# Altium schematic sheet BioZ_Sensor.SchDoc
size 420 x 297 mm
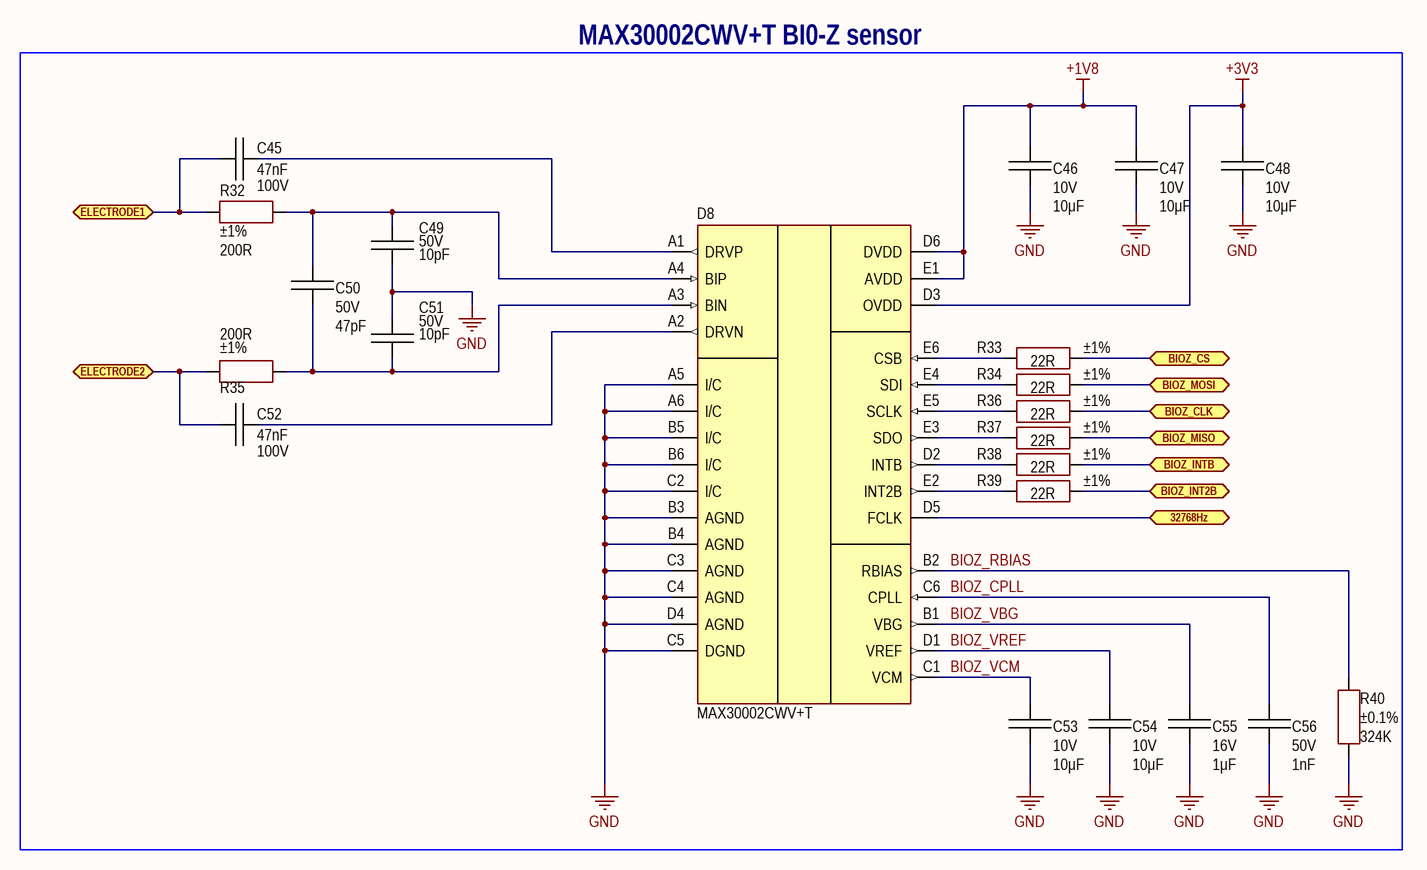
[diagram p0: BioZ_Sensor.SchDoc]

## Parts
C45  value 47nF  Voltage: 100V  [CAP: 0805]
C46  value 10μF  Voltage: 10V  [CAP: 0805]
C47  value 10μF  Voltage: 10V  [CAP: 0805]
C48  value 10μF  Voltage: 10V  [CAP: 0805]
C49  value 10pF  Voltage: 50V  [CAP: 0805]
C50  value 47pF  Voltage: 50V  [CAP: 0805]
C51  value 10pF  Voltage: 50V  [CAP: 0805]
C52  value 47nF  Voltage: 100V  [CAP: 0805]
C53  value 10μF  Voltage: 10V  [CAP: 0805]
C54  value 10μF  Voltage: 10V  [CAP: 0805]
C55  value 1μF  Voltage: 16V  [CAP: 0805]
C56  value 1nF  Voltage: 50V  [CAP: 0805]
D8  (no value)  [IC: 30-WLP]
R32  value 200R  Tolerance: ±1%  [RES: 0805]
R33  value 22R  Tolerance: ±1%  [RES: 0805]
R34  value 22R  Tolerance: ±1%  [RES: 0805]
R35  value 200R  Tolerance: ±1%  [RES: 0805]
R36  value 22R  Tolerance: ±1%  [RES: 0805]
R37  value 22R  Tolerance: ±1%  [RES: 0805]
R38  value 22R  Tolerance: ±1%  [RES: 0805]
R39  value 22R  Tolerance: ±1%  [RES: 0805]
R40  value 324K  Tolerance: ±0.1%  [RES: 0805]

## Blocks framed on the sheet
MAX30002CWV+T BI0-Z sensor: C45-C56 D8 R32-R40

## Ports
32768Hz (bidir), BIOZ_CLK (bidir), BIOZ_CS (bidir), BIOZ_INT2B (bidir), BIOZ_INTB (bidir), BIOZ_MISO (bidir), BIOZ_MOSI (bidir), ELECTRODE1 (bidir), ELECTRODE2 (bidir)

## Nets
+1V8: C46.2 C47.2 D8.D6(DVDD) D8.E1(AVDD)
+3V3: C48.2 D8.D3(OVDD)
GND: C46.1 C47.1 C48.1 C49.1 C51.2 C53.1 C54.1 C55.1 C56.1 D8.A5(I/C) D8.A6(I/C) D8.B3(AGND) D8.B4(AGND) D8.B5(I/C) D8.B6(I/C) D8.C2(I/C) D8.C3(AGND) D8.C4(AGND) D8.C5(DGND) D8.D4(AGND) R40.1
32768Hz: D8.D5(FCLK) ; port 32768Hz
BIOZ_CLK: R36.2 ; port BIOZ_CLK
BIOZ_CPLL: C56.2 D8.C6(CPLL)
BIOZ_CS: R33.2 ; port BIOZ_CS
BIOZ_INT2B: R39.2 ; port BIOZ_INT2B
BIOZ_INTB: R38.2 ; port BIOZ_INTB
BIOZ_MISO: R37.2 ; port BIOZ_MISO
BIOZ_MOSI: R34.2 ; port BIOZ_MOSI
BIOZ_RBIAS: D8.B2(RBIAS) R40.2
BIOZ_VBG: C55.2 D8.B1(VBG)
BIOZ_VCM: C53.2 D8.C1(VCM)
BIOZ_VREF: C54.2 D8.D1(VREF)
ELECTRODE1: C45.2 R32.2 ; port ELECTRODE1
ELECTRODE2: C52.2 R35.2 ; port ELECTRODE2
NetC45_1: C45.1 D8.A1(DRVP)
NetC49_2: C49.2 C50.2 D8.A4(BIP) R32.1
NetC50_1: C50.1 C51.1 D8.A3(BIN) R35.1
NetC52_1: C52.1 D8.A2(DRVN)
NetD8_D2: D8.D2(INTB) R38.1
NetD8_E2: D8.E2(INT2B) R39.1
NetD8_E3: D8.E3(SDO) R37.1
NetD8_E4: D8.E4(SDI) R34.1
NetD8_E5: D8.E5(SCLK) R36.1
NetD8_E6: D8.E6(CSB) R33.1

## Notes on the sheet
- Author
- Manufacturer
- Date
- Page
- Total pages
- Size page
- A3
- Materials

## Library data of the parts
C45 C52 = Ceramic_0805: 0.047 µF ±10% 100V Ceramic Capacitor X7R 0805 (2012 Metric); Manufacturer: Yageo; PartNumber: CC0805KKX7R0BB473; ValueManufacturerPartNumber: Ceramic capacitor, 47nF, X7R, ±10%, 100V, 0805, -55...+125°C; Package: 0805; HelpURL: https://www.digikey.com/en/products/detail/yageo/CC0805KKX7R0BB473/5195282; Temperature: -55...+125°C; TypeCapacitor: Ceramic capacitor; Tolerance: ±10%; TypeDielectric: X7R
C46-C48 C53 C54 = Ceramic_0805: 10 µF ±10% 10V Ceramic Capacitor X7R 0805 (2012 Metric); Manufacturer: Yageo; PartNumber: CC0805KFX7R6BB106; ValueManufacturerPartNumber: Ceramic capacitor, 10μF, X7R, ±10%, 10V, 0805, -55...+125°C; Package: 0805; HelpURL: https://www.digikey.com/en/products/detail/yageo/CC0805KFX7R6BB106/11611326; Temperature: -55...+125°C; TypeCapacitor: Ceramic capacitor; Tolerance: ±10%; TypeDielectric: X7R
C49 C51 = Ceramic_0805: 10 pF ±1% 50V Ceramic Capacitor C0G, NP0 0805 (2012 Metric); Manufacturer: Yageo; PartNumber: CC0805FRNPO9BN100; ValueManufacturerPartNumber: Ceramic capacitor, 10pF, NP0, ±5%, 50V, 0805, -55...+125°C; Tolerance: ±5%; Package: 0805; HelpURL: https://www.digikey.com/en/products/detail/yageo/CC0805FRNPO9BN100/5883922; Temperature: -55...+125°C; TypeCapacitor: Ceramic capacitor; TypeDielectric: NP0
C50 = Ceramic_0805: 47 pF ±5% 50V Ceramic Capacitor C0G, NP0 0805 (2012 Metric); Manufacturer: Yageo; PartNumber: CC0805JRNPO9BN470; ValueManufacturerPartNumber: Ceramic capacitor, 47pF, NP0, ±10%, 50V, 0805, -55...+125°C; Tolerance: ±10%; Package: 0805; HelpURL: https://www.digikey.com/en/products/detail/yageo/CC0805JRNPO9BN470/302841; Temperature: -55...+125°C; TypeCapacitor: Ceramic capacitor; TypeDielectric: NP0
C55 = Ceramic_0805: 1 µF ±10% 16V Ceramic Capacitor X7R 0805 (2012 Metric); Manufacturer: Yageo; PartNumber: CC0805KKX7R7BB105; ValueManufacturerPartNumber: Ceramic capacitor, 1μF, X7R, ±10%, 16V, 0805, -55...+125°C; Package: 0805; HelpURL: https://www.digikey.com/en/products/detail/yageo/CC0805KKX7R7BB105/2103103; Temperature: -55...+125°C; TypeCapacitor: Ceramic capacitor; Tolerance: ±10%; TypeDielectric: X7R
C56 = Ceramic_0805: 1000 pF ±5% 50V Ceramic Capacitor C0G, NP0 0805 (2012 Metric); Manufacturer: Yageo; PartNumber: CC0805JRNPO9BN102; ValueManufacturerPartNumber: Ceramic capacitor, 1nF, NP0, ±5%, 50V, 0805, -55...+125°C; Package: 0805; HelpURL: https://www.digikey.com/en/products/detail/yageo/CC0805JRNPO9BN102/302856; Temperature: -55...+125°C; TypeCapacitor: Ceramic capacitor; Tolerance: ±5%; TypeDielectric: NP0
D8 = MAX30002CWV+T: Biopotential and Bioimpedance sensor; Manufacturer: Maxim Integrated; Supply: 1.65...3.6V; HelpURL: https://www.digikey.com/en/products/detail/maxim-integrated/MAX30002CWV-T/9833528; Package: 30-WLP; ComponentType: IC Biopotential and Bioimpedance sensor; ValueManufacturerPartNumber: =ComponentType+', '+Sensing+', '+Accuracy+', '+GainBandwidth+', '+Sensitivity+', '+Temperature+', '+Package; Temperature: 0°C..+70°C; Sensing: Biopotential and Bioimpedance sensor; PartNumber: MAX30002CWV+T
R32 R35 = Resistor_0805: 200 Ohms ±1% 0.125W, 1/8W Chip Resistor 0805 (2012 Metric) Moisture Resistant Thick Film; Manufacturer: Yageo; PartNumber: RC0805FR-07200RL; ValueManufacturerPartNumber: Resistor film, 200R, ±1%, 0805, 0.125W, -55...+125°C; TypeResistor: Resistor film; Package: 0805; HelpURL: https://www.digikey.com/en/products/detail/yageo/RC0805FR-07200RL/727723; Temperature: -55...+125°C; Power: 0.125W
R33 R34 R36-R39 = Resistor_0805: 22 Ohms ±1% 0.125W, 1/8W Chip Resistor 0805 (2012 Metric) Moisture Resistant Thick Film; Manufacturer: Yageo; PartNumber: RC0805FR-0722RL; ValueManufacturerPartNumber: Resistor film, 22R, ±1%, 0805, 0.125W, -55...+125°C; TypeResistor: Resistor film; Package: 0805; HelpURL: https://www.digikey.com/en/products/detail/yageo/RC0805FR-0722RL/727735; Temperature: -55...+125°C; Power: 0.125W
R40 = Resistor_0805: 324 kOhms ±0.1% 0.2W, 1/5W Chip Resistor 0805 (2012 Metric) Anti-Sulfur, Automotive AEC-Q200 Thin Film; Manufacturer: TE Connectivity Passive Product; PartNumber: RQ73C2A324KBTD; ValueManufacturerPartNumber: Resistor film, 324K, ±0.1%, 0805, 0.125W, -55...+125°C; TypeResistor: Resistor film; Power: 0.125W; Package: 0805; HelpURL: https://www.digikey.com/en/products/detail/te-connectivity-passive-product/RQ73C2A324KBTD/9479991; Temperature: -55...+125°C